# EAGLE schematic led-test-1 (EAGLE 8.4.0)
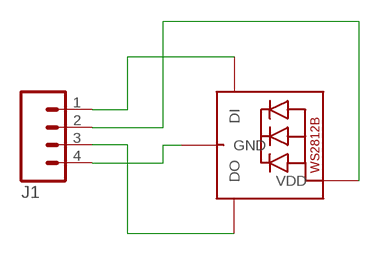
[diagram p0: schematic, sheet 1]

## Parts
J1  M04LOCK  [1X04_LOCK]
LED-2  WS2812B5050  [WS2812B]

## Nets
N$1: J1.1 LED-2.4-DIN(DI)
N$2: J1.2 LED-2.1-VDD(VDD)
N$3: J1.3 LED-2.2-DOUT(DO)
N$4: J1.4 LED-2.3-GND(GND)

## Library data of the parts
J1 = SparkFun-Connectors:M04: Header 4 Standard 4-pin 0.1" header. Use with straight break away headers (SKU : PRT-00116), right angle break away headers (PRT-00553), swiss pins (PRT-00743), machine pins (PRT-00117), and female headers (PRT-00115). Molex polarized connector foot print use with SKU : PRT-08231 with associated crimp pins and housings. 1MM SMD Version SKU: PRT-10208; PROD_ID: CONN-09696
LED-2 = adafruit:WS2812B